# EAGLE design CocoMEMJr_v1.00 (EAGLE 7.7.0)

## Sheet 1 of 4: CPU
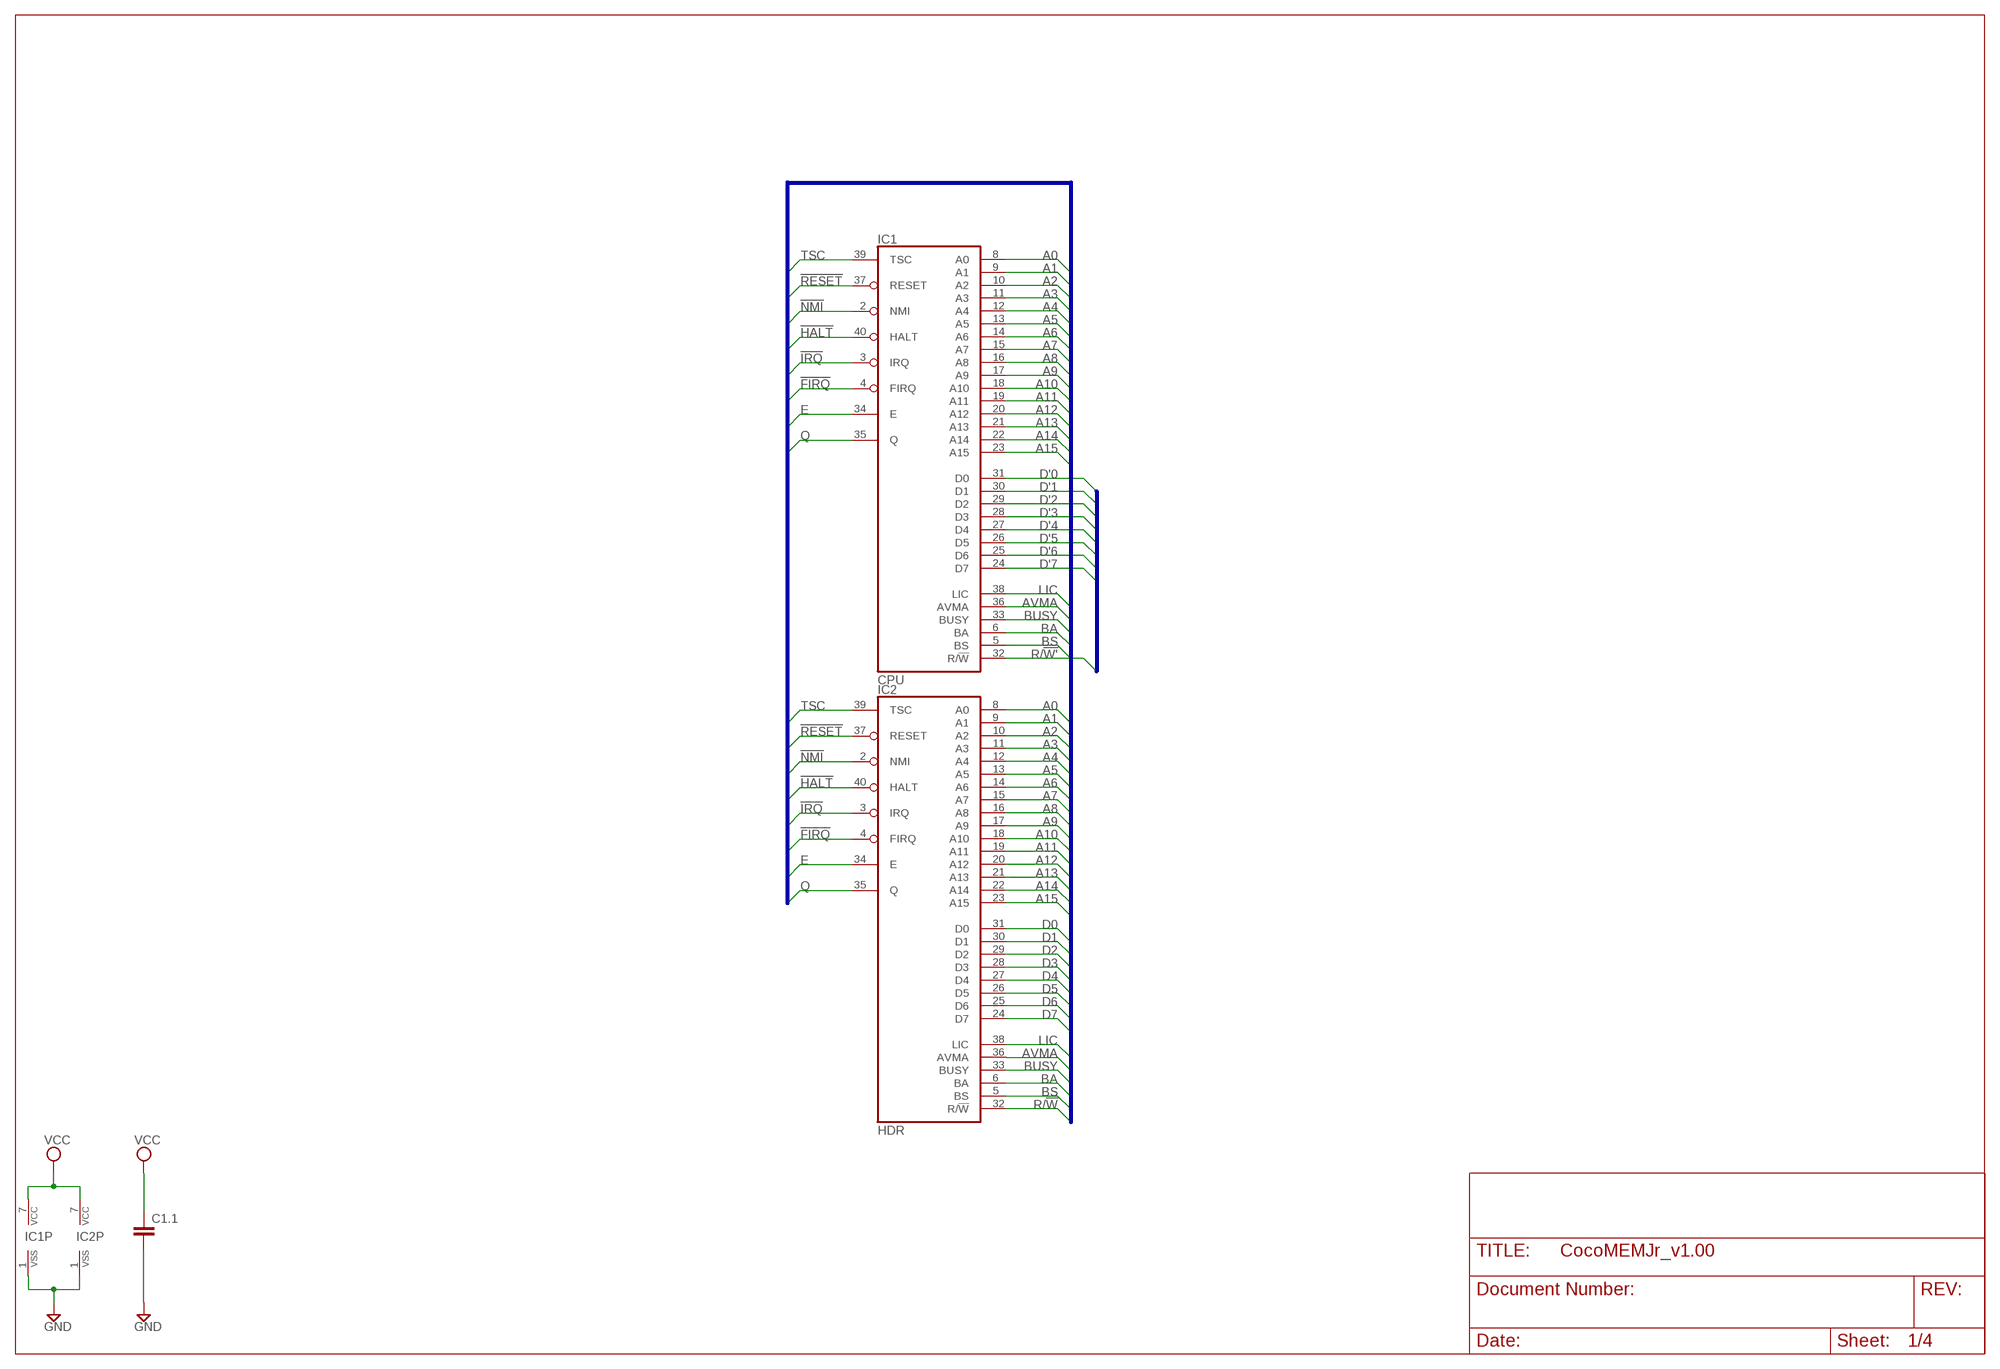
[diagram p0: schematic, sheet 1]

### Parts
C1.1  C-EUC0402  [C0402]
IC1  CPU  MC6809ER  [DIL40-ROUNDPAD]
IC2  HDR  MC6809ER  [DIL40-ROUNDPAD]

### Nets
!FIRQ: IC1.4(FIRQ) IC2.4(FIRQ)
!HALT: IC1.40(HALT) IC2.40(HALT)
!IRQ: IC1.3(IRQ) IC2.3(IRQ)
!NMI: IC1.2(NMI) IC2.2(NMI)
!RESET: IC1.37(RESET) IC2.37(RESET) ; also sheet 2
A0: IC1.8(A0) IC2.8(A0) ; also sheet 2,3
A1: IC1.9(A1) IC2.9(A1) ; also sheet 2,3
A2: IC1.10(A2) IC2.10(A2) ; also sheet 2,3
A3: IC1.11(A3) IC2.11(A3) ; also sheet 2,3
A4: IC1.12(A4) IC2.12(A4) ; also sheet 2,3
A5: IC1.13(A5) IC2.13(A5) ; also sheet 2,3
A6: IC1.14(A6) IC2.14(A6) ; also sheet 2,3
A7: IC1.15(A7) IC2.15(A7) ; also sheet 2,3
A8: IC1.16(A8) IC2.16(A8) ; also sheet 2,3
A9: IC1.17(A9) IC2.17(A9) ; also sheet 2,3
A10: IC1.18(A10) IC2.18(A10) ; also sheet 2,3
A11: IC1.19(A11) IC2.19(A11) ; also sheet 2,3
A12: IC1.20(A12) IC2.20(A12) ; also sheet 2,3
A13: IC1.21(A13) IC2.21(A13) ; also sheet 2
A14: IC1.22(A14) IC2.22(A14) ; also sheet 2
A15: IC1.23(A15) IC2.23(A15) ; also sheet 2
AVMA: IC1.36(AVMA) IC2.36(AVMA)
BA: IC1.6(BA) IC2.6(BA)
BS: IC1.5(BS) IC2.5(BS)
BUSY: IC1.33(BUSY) IC2.33(BUSY)
D0: IC2.31(D0) ; also sheet 2
D1: IC2.30(D1) ; also sheet 2
D2: IC2.29(D2) ; also sheet 2
D3: IC2.28(D3) ; also sheet 2
D4: IC2.27(D4) ; also sheet 2
D5: IC2.26(D5) ; also sheet 2
D6: IC2.25(D6) ; also sheet 2
D7: IC2.24(D7) ; also sheet 2
D'0: IC1.31(D0) ; also sheet 2
D'1: IC1.30(D1) ; also sheet 2
D'2: IC1.29(D2) ; also sheet 2
D'3: IC1.28(D3) ; also sheet 2
D'4: IC1.27(D4) ; also sheet 2
D'5: IC1.26(D5) ; also sheet 2
D'6: IC1.25(D6) ; also sheet 2
D'7: IC1.24(D7) ; also sheet 2
E: IC1.34(E) IC2.34(E) ; also sheet 2
GND: C1.1.2 IC1.1(VSS) IC2.1(VSS) ; also sheet 2,3,4
LIC: IC1.38(LIC) IC2.38(LIC)
Q: IC1.35(Q) IC2.35(Q) ; also sheet 2
R/!W: IC2.32(R/!W) ; also sheet 2
R/!W': IC1.32(R/!W) ; also sheet 2
TSC: IC1.39(TSC) IC2.39(TSC)
VCC: C1.1.1 IC1.7(VCC) IC2.7(VCC) ; also sheet 3,4

### Buses
TSC,LIC,!RESET,!NMI,!HALT,!IRQ,!FIRQ,AVMA,BUSY,A[0..15],D[0..7],E,Q,BA,BS,R/!W
R/!W',D'[0..7]

## Sheet 2 of 4: LOGIC
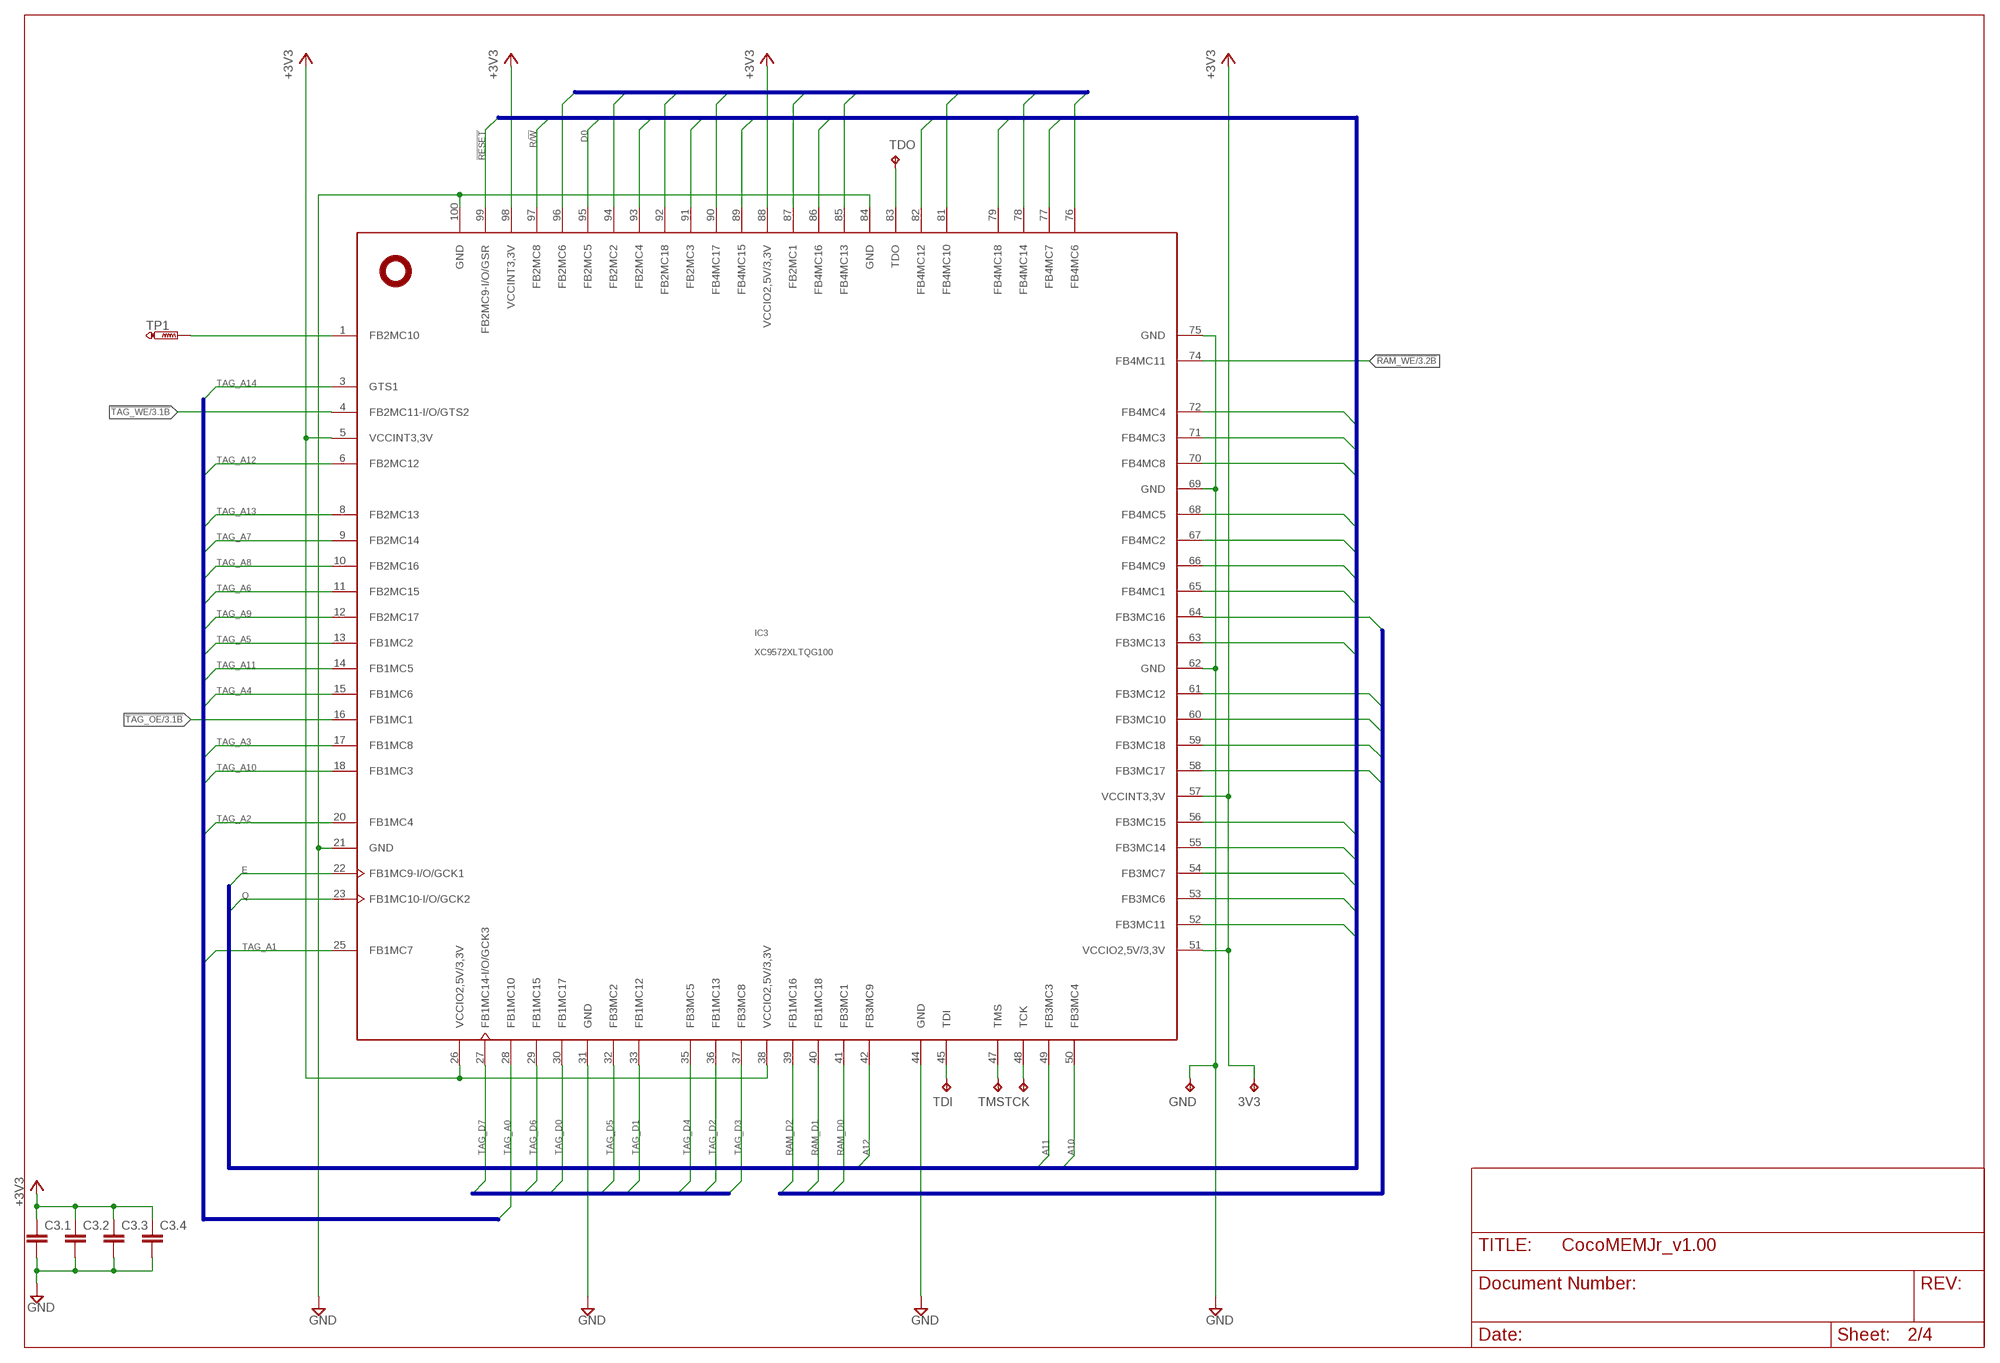
[diagram p1: schematic, sheet 2]

### Parts
3V3  TPTP08R  [TP08R]
C3.1  C-EUC0402  [C0402]
C3.2  C-EUC0402  [C0402]
C3.3  C-EUC0402  [C0402]
C3.4  C-EUC0402  [C0402]
GND  TPTP08R  [TP08R]
IC3  XC9572XLTQG100  [TQFP100]
TCK  TPTP08R  [TP08R]
TDI  TPTP08R  [TP08R]
TDO  TPTP08R  [TP08R]
TMS  TPTP08R  [TP08R]
TP1  PTR1B2,54  [B2,54]

### Nets
!RAM_WE: IC3.74(FB4MC11) ; also sheet 3
!RESET: IC3.99(FB2MC9-I/O/GSR) ; also sheet 1
!TAG_OE: IC3.16(FB1MC1) ; also sheet 3
!TAG_WE: IC3.4(FB2MC11-I/O/GTS2) ; also sheet 3
+3V3: 3V3.TP C3.1.1 C3.2.1 C3.3.1 C3.4.1 IC3.5(VCCINT3,3V) IC3.26(VCCIO2,5V/3,3V) IC3.38(VCCIO2,5V/3,3V) IC3.51(VCCIO2,5V/3,3V) IC3.57(VCCINT3,3V) IC3.88(VCCIO2,5V/3,3V) IC3.98(VCCINT3,3V) ; also sheet 4
A0: IC3.72(FB4MC4) ; also sheet 1,3
A1: IC3.71(FB4MC3) ; also sheet 1,3
A2: IC3.70(FB4MC8) ; also sheet 1,3
A3: IC3.68(FB4MC5) ; also sheet 1,3
A4: IC3.52(FB3MC11) ; also sheet 1,3
A5: IC3.67(FB4MC2) ; also sheet 1,3
A6: IC3.53(FB3MC6) ; also sheet 1,3
A7: IC3.54(FB3MC7) ; also sheet 1,3
A8: IC3.55(FB3MC14) ; also sheet 1,3
A9: IC3.56(FB3MC15) ; also sheet 1,3
A10: IC3.50(FB3MC4) ; also sheet 1,3
A11: IC3.49(FB3MC3) ; also sheet 1,3
A12: IC3.42(FB3MC9) ; also sheet 1,3
A13: IC3.63(FB3MC13) ; also sheet 1
A14: IC3.65(FB4MC1) ; also sheet 1
A15: IC3.66(FB4MC9) ; also sheet 1
D0: IC3.95(FB2MC5) ; also sheet 1
D1: IC3.93(FB2MC4) ; also sheet 1
D2: IC3.91(FB2MC3) ; also sheet 1
D3: IC3.89(FB4MC15) ; also sheet 1
D4: IC3.86(FB4MC16) ; also sheet 1
D5: IC3.82(FB4MC12) ; also sheet 1
D6: IC3.79(FB4MC18) ; also sheet 1
D7: IC3.77(FB4MC7) ; also sheet 1
D'0: IC3.94(FB2MC2) ; also sheet 1
D'1: IC3.92(FB2MC18) ; also sheet 1
D'2: IC3.90(FB4MC17) ; also sheet 1
D'3: IC3.87(FB2MC1) ; also sheet 1
D'4: IC3.85(FB4MC13) ; also sheet 1
D'5: IC3.81(FB4MC10) ; also sheet 1
D'6: IC3.78(FB4MC14) ; also sheet 1
D'7: IC3.76(FB4MC6) ; also sheet 1
E: IC3.22(FB1MC9-I/O/GCK1) ; also sheet 1
GND: C3.1.2 C3.2.2 C3.3.2 C3.4.2 GND.TP IC3.21(GND) IC3.31(GND) IC3.44(GND) IC3.62(GND) IC3.69(GND) IC3.75(GND) IC3.84(GND) IC3.100(GND) ; also sheet 1,3,4
N$1: IC3.1(FB2MC10) TP1.TP
N$5: IC3.45(TDI) TDI.TP
N$6: IC3.47(TMS) TMS.TP
N$7: IC3.48(TCK) TCK.TP
N$8: IC3.83(TDO) TDO.TP
Q: IC3.23(FB1MC10-I/O/GCK2) ; also sheet 1
R/!W: IC3.97(FB2MC8) ; also sheet 1
R/!W': IC3.96(FB2MC6) ; also sheet 1
RAM_D0: IC3.41(FB3MC1) ; also sheet 3
RAM_D1: IC3.40(FB1MC18) ; also sheet 3
RAM_D2: IC3.39(FB1MC16) ; also sheet 3
RAM_D3: IC3.58(FB3MC17) ; also sheet 3
RAM_D4: IC3.59(FB3MC18) ; also sheet 3
RAM_D5: IC3.60(FB3MC10) ; also sheet 3
RAM_D6: IC3.61(FB3MC12) ; also sheet 3
RAM_D7: IC3.64(FB3MC16) ; also sheet 3
TAG_A0: IC3.28(FB1MC10) ; also sheet 3
TAG_A1: IC3.25(FB1MC7) ; also sheet 3
TAG_A2: IC3.20(FB1MC4) ; also sheet 3
TAG_A3: IC3.17(FB1MC8) ; also sheet 3
TAG_A4: IC3.15(FB1MC6) ; also sheet 3
TAG_A5: IC3.13(FB1MC2) ; also sheet 3
TAG_A6: IC3.11(FB2MC15) ; also sheet 3
TAG_A7: IC3.9(FB2MC14) ; also sheet 3
TAG_A8: IC3.10(FB2MC16) ; also sheet 3
TAG_A9: IC3.12(FB2MC17) ; also sheet 3
TAG_A10: IC3.18(FB1MC3) ; also sheet 3
TAG_A11: IC3.14(FB1MC5) ; also sheet 3
TAG_A12: IC3.6(FB2MC12) ; also sheet 3
TAG_A13: IC3.8(FB2MC13) ; also sheet 3
TAG_A14: IC3.3(GTS1) ; also sheet 3
TAG_D0: IC3.30(FB1MC17) ; also sheet 3
TAG_D1: IC3.33(FB1MC12) ; also sheet 3
TAG_D2: IC3.36(FB1MC13) ; also sheet 3
TAG_D3: IC3.37(FB3MC8) ; also sheet 3
TAG_D4: IC3.35(FB3MC5) ; also sheet 3
TAG_D5: IC3.32(FB3MC2) ; also sheet 3
TAG_D6: IC3.29(FB1MC15) ; also sheet 3
TAG_D7: IC3.27(FB1MC14-I/O/GCK3) ; also sheet 3

### Buses
TSC,LIC,!RESET,!NMI,!HALT,!IRQ,!FIRQ,AVMA,BUSY,A[0..15],D[0..7],E,Q,BA,BS,R/!W
R/!W',D'[0..7]
RAM_D[0..7]
TAG_D[0..7]
TAG_A[0..14]

## Sheet 3 of 4: MEMORY
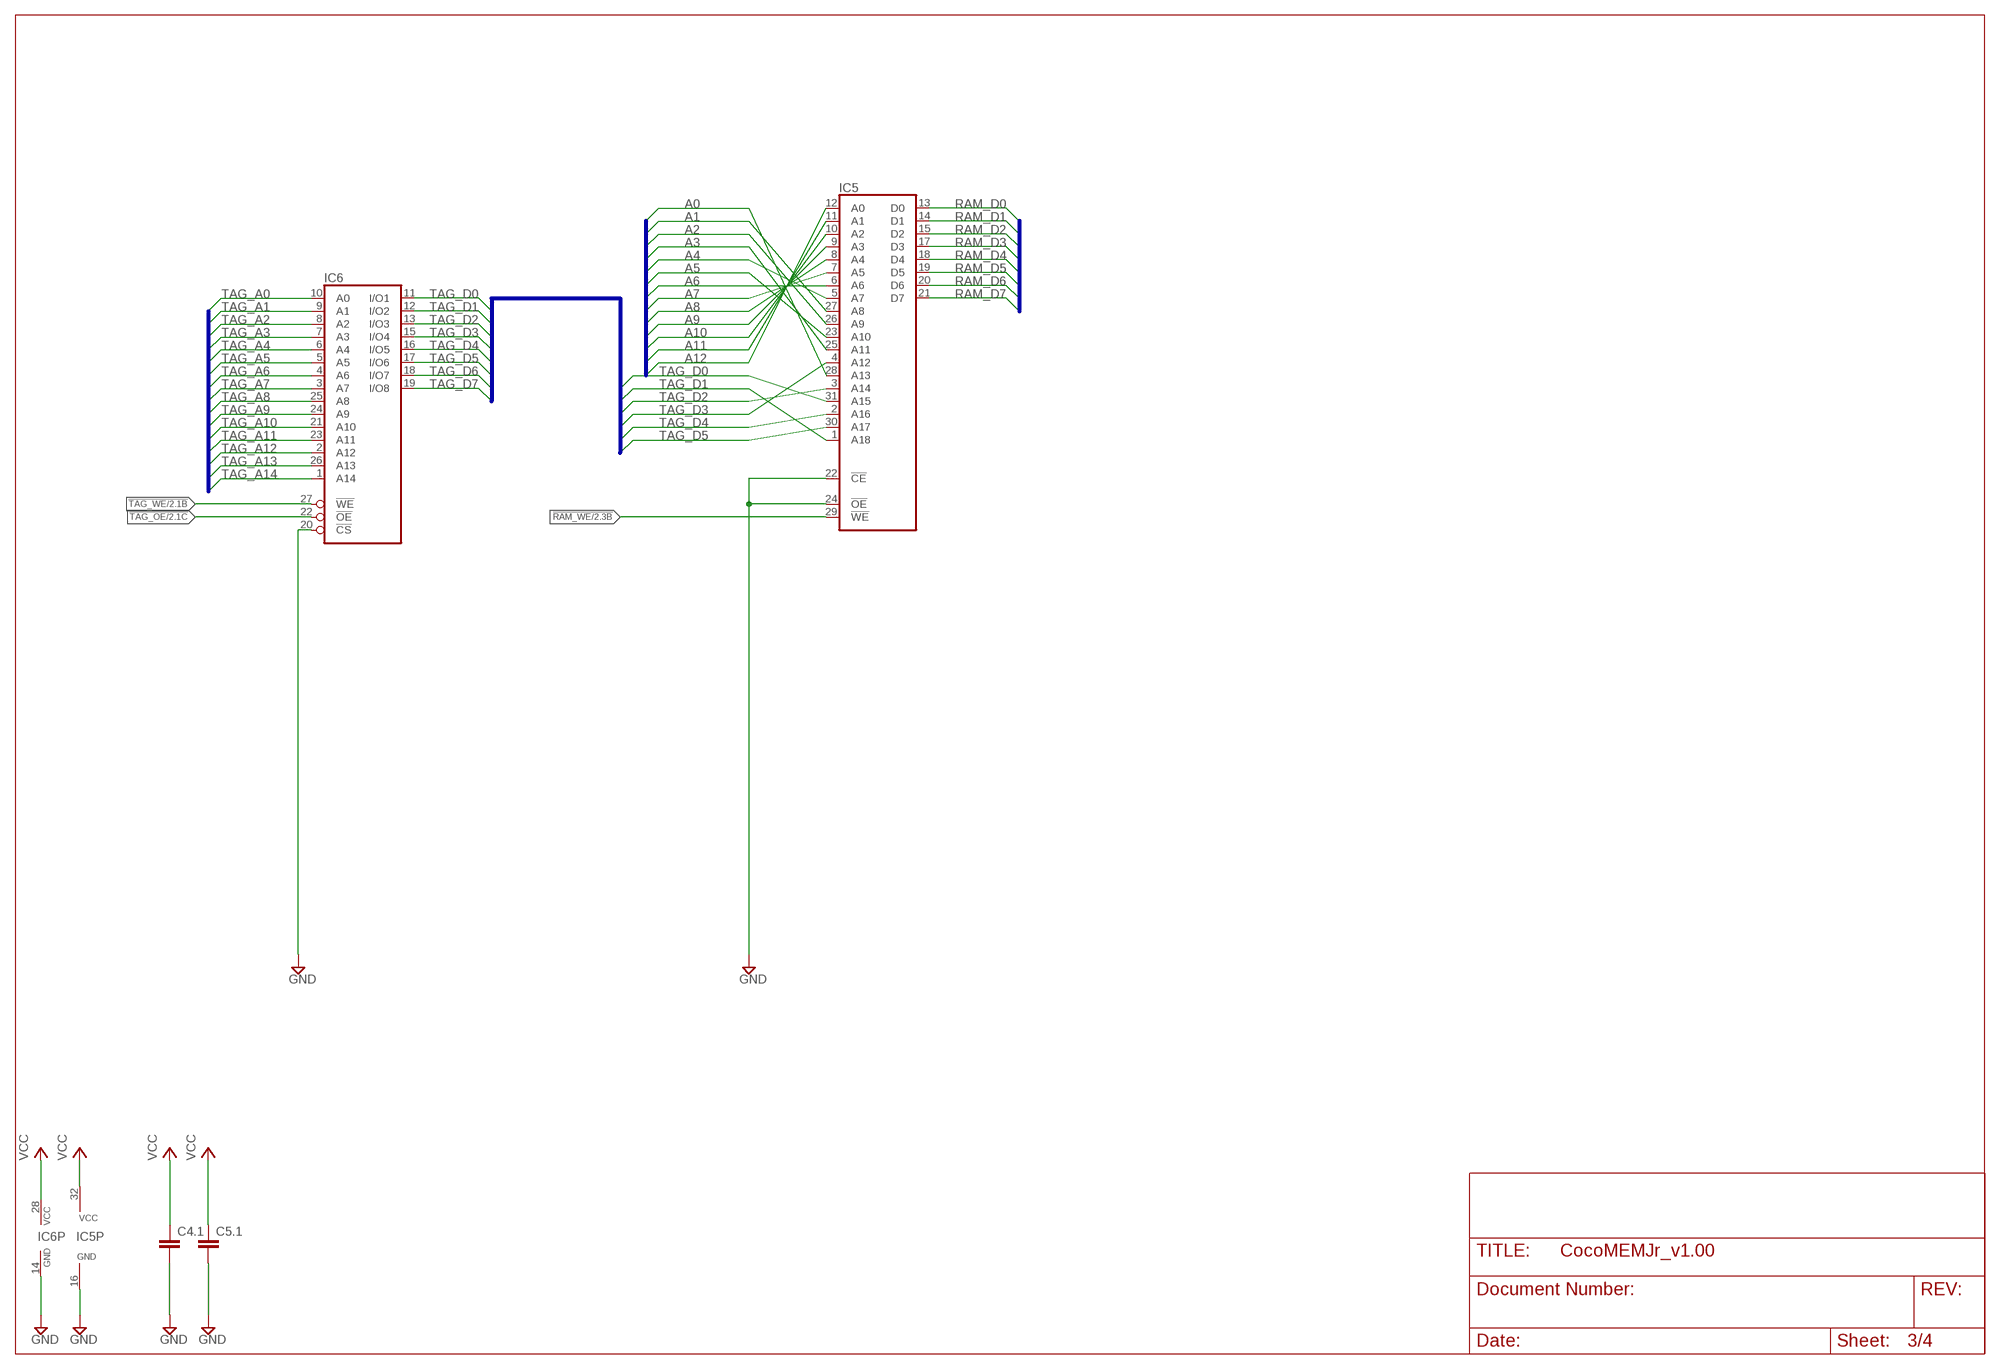
[diagram p2: schematic, sheet 3]

### Parts
C4.1  C-EUC0402  [C0402]
C5.1  C-EUC0402  [C0402]
IC5  AS6C4008PCNR  [DIL32-RP]
IC6  71256SAR  [DIL28-3RP]

### Nets
!RAM_WE: IC5.29(!WE) ; also sheet 2
!TAG_OE: IC6.22(!OE) ; also sheet 2
!TAG_WE: IC6.27(!WE) ; also sheet 2
A0: IC5.28(A13) ; also sheet 1,2
A1: IC5.27(A8) ; also sheet 1,2
A2: IC5.26(A9) ; also sheet 1,2
A3: IC5.25(A11) ; also sheet 1,2
A4: IC5.5(A7) ; also sheet 1,2
A5: IC5.23(A10) ; also sheet 1,2
A6: IC5.6(A6) ; also sheet 1,2
A7: IC5.7(A5) ; also sheet 1,2
A8: IC5.8(A4) ; also sheet 1,2
A9: IC5.9(A3) ; also sheet 1,2
A10: IC5.10(A2) ; also sheet 1,2
A11: IC5.11(A1) ; also sheet 1,2
A12: IC5.12(A0) ; also sheet 1,2
GND: C4.1.2 C5.1.2 IC5.16(GND) IC5.22(!CE) IC5.24(!OE) IC6.14(GND) IC6.20(!CS) ; also sheet 1,2,4
RAM_D0: IC5.13(D0) ; also sheet 2
RAM_D1: IC5.14(D1) ; also sheet 2
RAM_D2: IC5.15(D2) ; also sheet 2
RAM_D3: IC5.17(D3) ; also sheet 2
RAM_D4: IC5.18(D4) ; also sheet 2
RAM_D5: IC5.19(D5) ; also sheet 2
RAM_D6: IC5.20(D6) ; also sheet 2
RAM_D7: IC5.21(D7) ; also sheet 2
TAG_A0: IC6.10(A0) ; also sheet 2
TAG_A1: IC6.9(A1) ; also sheet 2
TAG_A2: IC6.8(A2) ; also sheet 2
TAG_A3: IC6.7(A3) ; also sheet 2
TAG_A4: IC6.6(A4) ; also sheet 2
TAG_A5: IC6.5(A5) ; also sheet 2
TAG_A6: IC6.4(A6) ; also sheet 2
TAG_A7: IC6.3(A7) ; also sheet 2
TAG_A8: IC6.25(A8) ; also sheet 2
TAG_A9: IC6.24(A9) ; also sheet 2
TAG_A10: IC6.21(A10) ; also sheet 2
TAG_A11: IC6.23(A11) ; also sheet 2
TAG_A12: IC6.2(A12) ; also sheet 2
TAG_A13: IC6.26(A13) ; also sheet 2
TAG_A14: IC6.1(A14) ; also sheet 2
TAG_D0: IC5.31(A15) IC6.11(I/O1) ; also sheet 2
TAG_D1: IC5.1(A18) IC6.12(I/O2) ; also sheet 2
TAG_D2: IC5.3(A14) IC6.13(I/O3) ; also sheet 2
TAG_D3: IC5.4(A12) IC6.15(I/O4) ; also sheet 2
TAG_D4: IC5.2(A16) IC6.16(I/O5) ; also sheet 2
TAG_D5: IC5.30(A17) IC6.17(I/O6) ; also sheet 2
TAG_D6: IC6.18(I/O7) ; also sheet 2
TAG_D7: IC6.19(I/O8) ; also sheet 2
VCC: C4.1.1 C5.1.1 IC5.32(VCC) IC6.28(VCC) ; also sheet 1,4

### Buses
RAM_D[0..7]
TSC,LIC,!RESET,!NMI,!HALT,!IRQ,!FIRQ,AVMA,BUSY,A[0..15],D[0..7],E,Q,BA,BS,R/!W
TAG_D[0..7]
TAG_A[0..14]

## Sheet 4 of 4: POWER
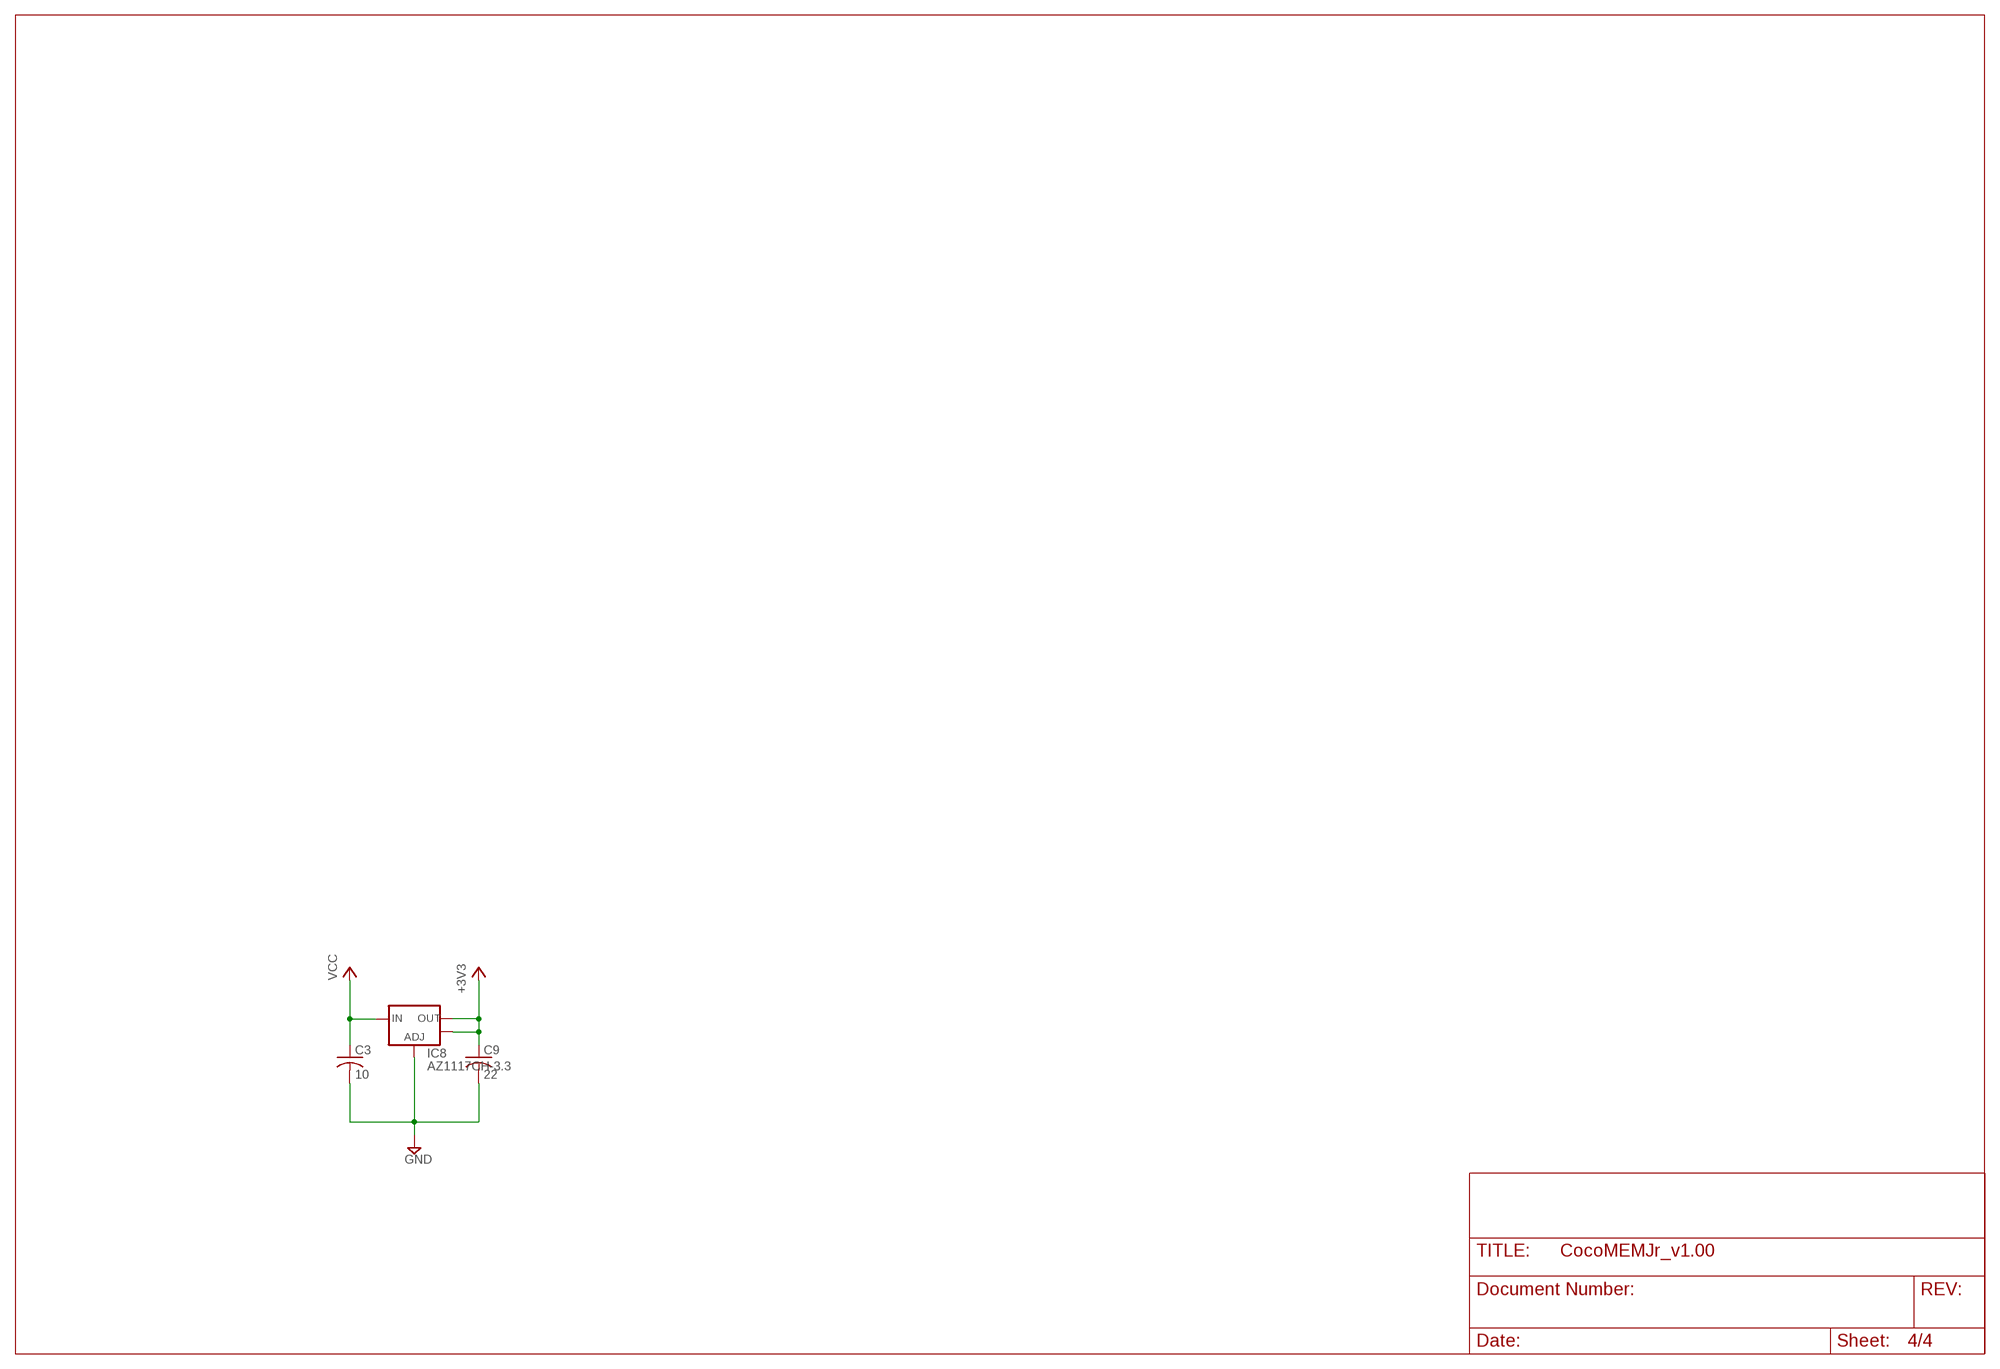
[diagram p3: schematic, sheet 4]

### Parts
C3  10  C-USC0805  [C0805]
C9  22  C-USC0805  [C0805]
IC8  AZ1117CH-3.3  V_REG_LM1117SOT223  [SOT223]

### Nets
+3V3: C9.1 IC8.2(OUT) IC8.4(OUT) ; also sheet 2
GND: C3.2 C9.2 IC8.1(ADJ) ; also sheet 1,2,3
VCC: C3.1 IC8.3(IN) ; also sheet 1,3

## Library data of the parts
3V3 GND TCK TDI TDO TMS = testpad:TP: Test pad
C1.1 C3.1-C3.4 C4.1 C5.1 = rcl:C-EU: CAPACITOR, European symbol
C3 C9 = rcl:C-US: CAPACITOR, American symbol
IC1 IC2 = micro-motorola:MC6809E: MICROCONTROLLER/MEMORY DEVICE
IC3 = xilinx_xc95XXXxl:XC9572XLTQG100
IC5 = memory-alliance:AS6C4008
IC6 = memory-idt-jlb:71256SA: MEMORY
IC8 = SparkFun:V_REG_LM1117: Voltage Regulator LM1117 Standard adjustable voltage regulator but in SMD form. Spark Fun Electronics SKU : COM-00595
TP1 = testpad:PTR1: TEST PIN

## Net classes
1 power: width 0.305 mm, drill 0.305 mm

## Board
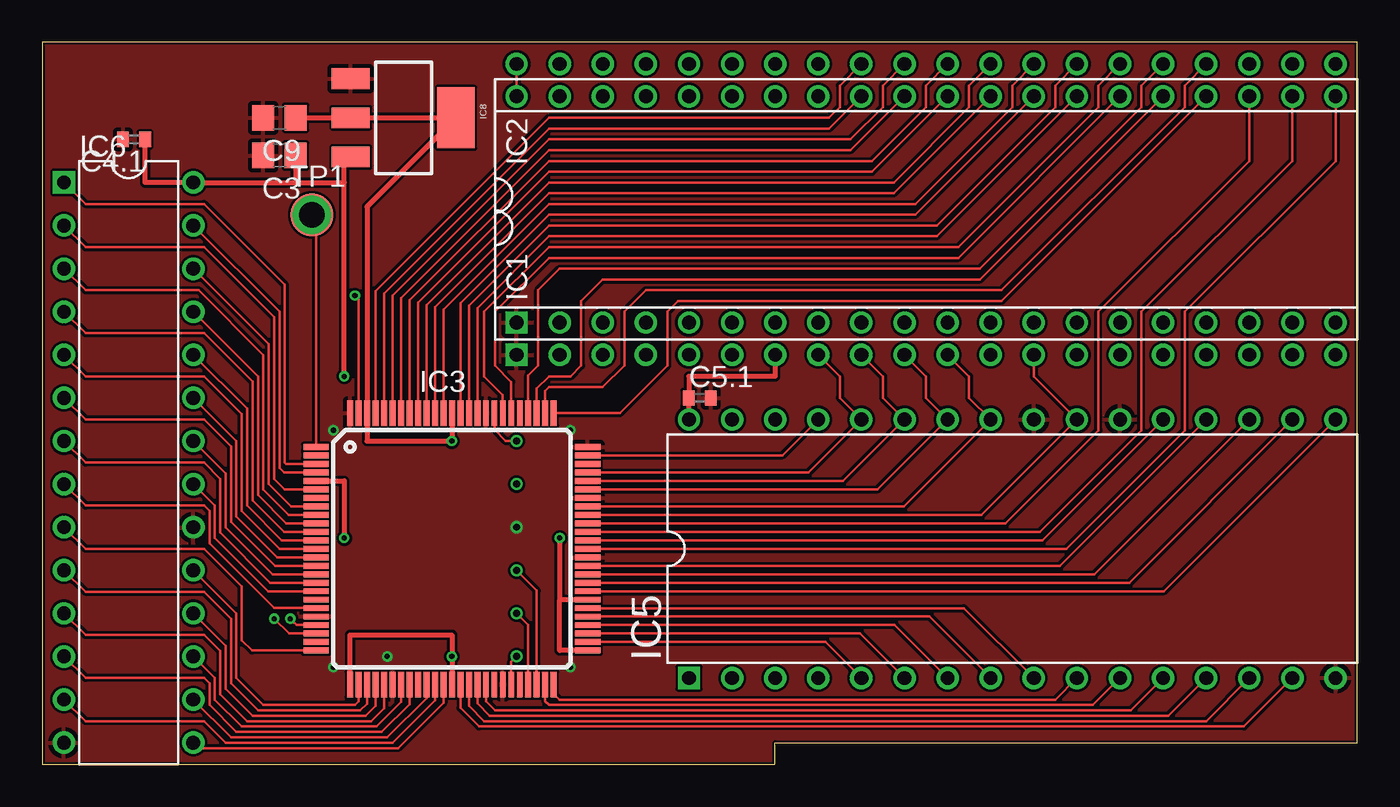
[diagram p4: board, top side]
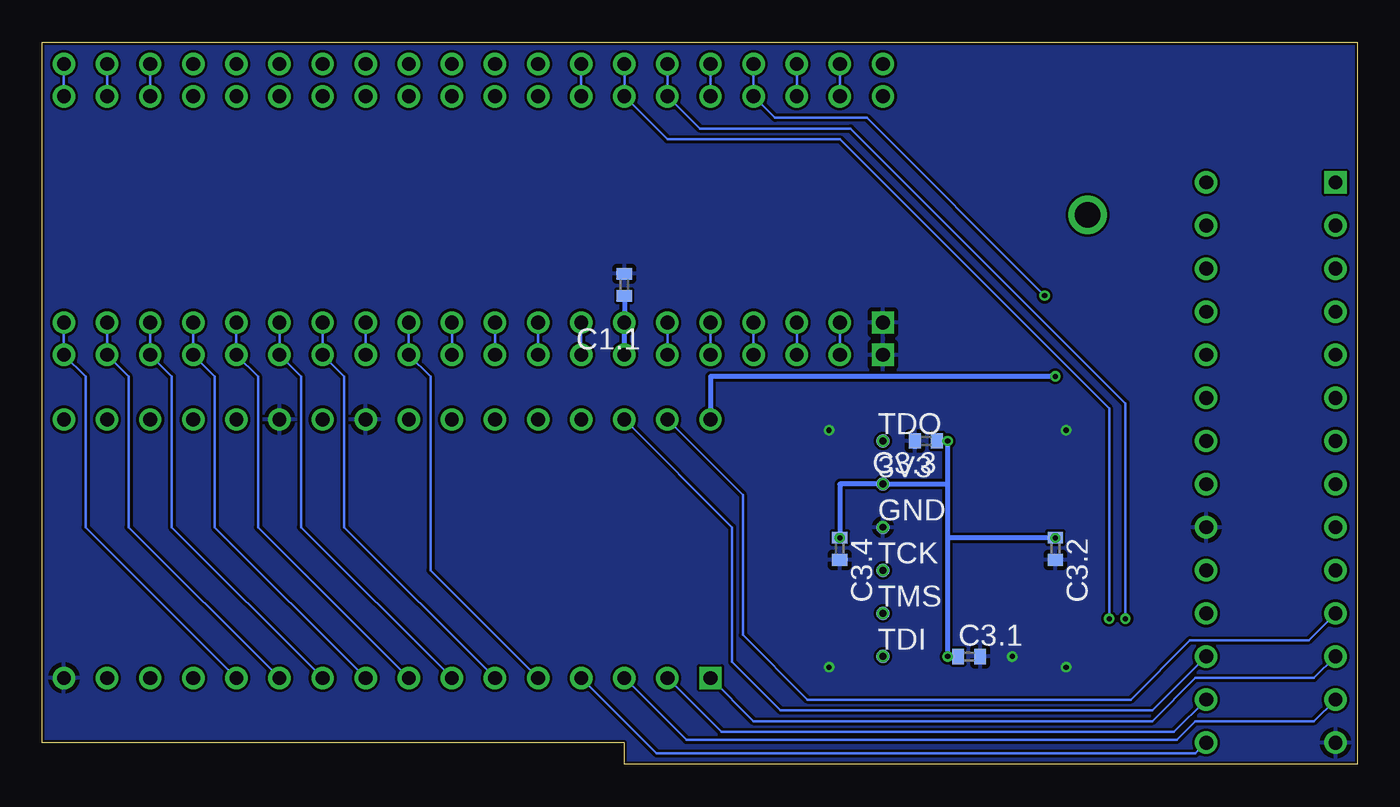
[diagram p5: board, bottom side, seen from below]

Size 77.47 x 42.55 mm. Coordinates in mm from the lower left corner, seen from the top.
Outline: 0,0 43.18,0 43.18,1.27 77.47,1.27 77.47,42.55 0,42.55 0,0
Copper layers (1*16): Top 0.035mm / dielectric 1.5mm / Bottom 0.035mm
Design rules "hackvana *": minimum track width 6mil, minimum drill 0.3mm, track to track 6mil, track to pad 6mil, pad to pad 6mil, via to via 6mil, smd to smd 0mil, copper to edge 6mil, drill to drill 6mil, minimum pad ring 10mil, minimum via ring 6mil, stop-mask expansion 2mil, vias tented up to drill 100mil, thermal gap 10mil

### Footprints (pad centres in the part's own frame; a part is rotated, then mirrored left to right if it is on the bottom)
TP08R = smd 0.8 x 0.8: TP 0,0
C0402 = smd 0.7 x 0.9: 1 -0.65,0; 2 0.65,0
C0805 = smd 1.3 x 1.5: 1 -0.95,0; 2 0.95,0
DIL40-ROUNDPAD = drill 0.813 square: 1 -24.13,-7.62 | drill 0.813: 2 -21.59,-7.62; 3 -19.05,-7.62; 4 -16.51,-7.62; 5 -13.97,-7.62; 6 -11.43,-7.62; 7 -8.89,-7.62; 8 -6.35,-7.62; 9 -3.81,-7.62; 10 -1.27,-7.62; 11 1.27,-7.62; 12 3.81,-7.62; 13 6.35,-7.62; 14 8.89,-7.62; 15 11.43,-7.62; 16 13.97,-7.62; 17 16.51,-7.62; 18 19.05,-7.62; 19 21.59,-7.62; 20 24.13,-7.62; 21 24.13,7.62; 22 21.59,7.62; 23 19.05,7.62; 24 16.51,7.62; 25 13.97,7.62; 26 11.43,7.62; 27 8.89,7.62; 28 6.35,7.62; 29 3.81,7.62; 30 1.27,7.62; 31 -1.27,7.62; 32 -3.81,7.62; 33 -6.35,7.62; 34 -8.89,7.62; 35 -11.43,7.62; 36 -13.97,7.62; 37 -16.51,7.62; 38 -19.05,7.62; 39 -21.59,7.62; 40 -24.13,7.62
TQFP100 = smd 1.5 x 0.35: 1 -8,6; 2 -8,5.5; 3 -8,5; 4 -8,4.5; 5 -8,4; 6 -8,3.5; 7 -8,3; 8 -8,2.5; 9 -8,2; 10 -8,1.5; 11 -8,1; 12 -8,0.5; 13 -8,0; 14 -8,-0.5; 15 -8,-1; 16 -8,-1.5; 17 -8,-2; 18 -8,-2.5; 19 -8,-3; 20 -8,-3.5; 21 -8,-4; 22 -8,-4.5; 23 -8,-5; 24 -8,-5.5; 25 -8,-6; 51 8,-6; 52 8,-5.5; 53 8,-5; 54 8,-4.5; 55 8,-4; 56 8,-3.5; 57 8,-3; 58 8,-2.5; 59 8,-2; 60 8,-1.5; 61 8,-1; 62 8,-0.5; 63 8,0; 64 8,0.5; 65 8,1; 66 8,1.5; 67 8,2; 68 8,2.5; 69 8,3; 70 8,3.5; 71 8,4; 72 8,4.5; 73 8,5; 74 8,5.5; 75 8,6 | smd 0.35 x 1.5: 26 -6,-8; 27 -5.5,-8; 28 -5,-8; 29 -4.5,-8; 30 -4,-8; 31 -3.5,-8; 32 -3,-8; 33 -2.5,-8; 34 -2,-8; 35 -1.5,-8; 36 -1,-8; 37 -0.5,-8; 38 0,-8; 39 0.5,-8; 40 1,-8; 41 1.5,-8; 42 2,-8; 43 2.5,-8; 44 3,-8; 45 3.5,-8; 46 4,-8; 47 4.5,-8; 48 5,-8; 49 5.5,-8; 50 6,-8; 76 6,8; 77 5.5,8; 78 5,8; 79 4.5,8; 80 4,8; 81 3.5,8; 82 3,8; 83 2.5,8; 84 2,8; 85 1.5,8; 86 1,8; 87 0.5,8; 88 0,8; 89 -0.5,8; 90 -1,8; 91 -1.5,8; 92 -2,8; 93 -2.5,8; 94 -3,8; 95 -3.5,8; 96 -4,8; 97 -4.5,8; 98 -5,8; 99 -5.5,8; 100 -6,8
DIL32-RP = drill 0.813 square: 1 -19.05,-7.62 | drill 0.813: 2 -16.51,-7.62; 3 -13.97,-7.62; 4 -11.43,-7.62; 5 -8.89,-7.62; 6 -6.35,-7.62; 7 -3.81,-7.62; 8 -1.27,-7.62; 9 1.27,-7.62; 10 3.81,-7.62; 11 6.35,-7.62; 12 8.89,-7.62; 13 11.43,-7.62; 14 13.97,-7.62; 15 16.51,-7.62; 16 19.05,-7.62; 17 19.05,7.62; 18 16.51,7.62; 19 13.97,7.62; 20 11.43,7.62; 21 8.89,7.62; 22 6.35,7.62; 23 3.81,7.62; 24 1.27,7.62; 25 -1.27,7.62; 26 -3.81,7.62; 27 -6.35,7.62; 28 -8.89,7.62; 29 -11.43,7.62; 30 -13.97,7.62; 31 -16.51,7.62; 32 -19.05,7.62
DIL28-3RP = drill 0.813 square: 1 -16.51,-3.81 | drill 0.813: 2 -13.97,-3.81; 3 -11.43,-3.81; 4 -8.89,-3.81; 5 -6.35,-3.81; 6 -3.81,-3.81; 7 -1.27,-3.81; 8 1.27,-3.81; 9 3.81,-3.81; 10 6.35,-3.81; 11 8.89,-3.81; 12 11.43,-3.81; 13 13.97,-3.81; 14 16.51,-3.81; 15 16.51,3.81; 16 13.97,3.81; 17 11.43,3.81; 18 8.89,3.81; 19 6.35,3.81; 20 3.81,3.81; 21 1.27,3.81; 22 -1.27,3.81; 23 -3.81,3.81; 24 -6.35,3.81; 25 -8.89,3.81; 26 -11.43,3.81; 27 -13.97,3.81; 28 -16.51,3.81
SOT223 = smd 1.219 x 2.235: 1 -2.311,-3.099; 2 0,-3.099; 3 2.311,-3.099 | smd 3.6 x 2.2: 4 0,3.099
B2,54 = smd 2.54 x 2.54: TP 0,0

### Placement (x,y rotation side)
3V3  27.94,16.51 0 bottom
C1.1  43.18,28.26 90 bottom
C3  13.97,35.88 180 top
C3.1  22.86,6.35 0 bottom
C3.2  17.78,12.7 270 bottom
C3.3  25.4,19.05 180 bottom
C3.4  30.48,12.7 270 bottom
C4.1  5.4,36.83 180 top
C5.1  38.73,21.59 0 top
C9  13.97,38.1 180 top
GND  27.94,13.97 0 bottom
IC1  52.07,31.75 0 top
IC2  52.07,33.66 0 top
IC3  24.13,12.7 0 top
IC5  57.15,12.7 0 top
IC6  5.08,17.78 270 top
IC8  21.27,38.1 270 top
TCK  27.94,11.43 0 bottom
TDI  27.94,6.35 0 bottom
TDO  27.94,19.05 0 bottom
TMS  27.94,8.89 0 bottom
TP1  15.88,32.38 0 top

### Tracks (layer width: path | path; a pad name or v marks a point on that pad's centre or on a via)
!FIRQ
  Bottom 0.152: IC2.4 IC1.4
!HALT
  Top 0.152: IC2.40 IC1.40
!IRQ
  Bottom 0.152: IC2.3 IC1.3
!NMI
  Bottom 0.152: IC2.2 IC1.2
!RAM_WE
  Top 0.152: IC5.29 43.6,18.2 IC3.74
!RESET  (via drill 0.3)
  Top 0.152: IC3.99 18.63,27.41 v18.41,27.62
  Bottom 0.152: v18.41,27.62 28.89,38.1 34.29,38.1 IC1.37 IC2.37
!TAG_OE
  Top 0.152: IC3.16 13.57,11.2 10.8,13.97 10.8,17.14 IC6.22
!TAG_WE
  Top 0.152: IC6.27 13.97,26.67 13.97,17.46 14.23,17.2 IC3.4
+3V3  (via drill 0.3, 0.41)
  Top 0.305: IC3.88 v24.13,19.05 19.13,19.05 IC3.98 19.13,32.86 IC8.4 IC8.2 C9.1 | IC3.51 30.48,6.7 30.48,9.7 | IC3.57 30.48,9.7 | IC3.5 17.78,16.7 v17.78,13.33 | IC3.38 v24.13,6.35 24.13,7.62 18.13,7.62 IC3.26 | v30.48,13.33 30.48,9.7
  Bottom 0.305: 24.13,13.33 v17.78,13.33 C3.2.1 | 24.13,13.33 v24.13,6.35 C3.1.1 | 24.13,16.51 v24.13,19.05 C3.3.1 | 24.13,16.51 24.13,13.33 | 24.13,16.51 3V3.TP 30.48,16.51 C3.4.1 v30.48,13.33
  other vias: 27.94,16.51
A0
  Top 0.152: IC1.8 46.99,22.86 46.99,21.59 IC5.28 45.14,17.2 IC3.72
  Bottom 0.152: IC2.8 IC1.8
A1
  Top 0.152: IC1.9 49.53,22.86 49.53,21.59 IC5.27 47.18,16.7 IC3.71
  Bottom 0.152: IC2.9 IC1.9
A2
  Top 0.152: IC1.10 52.07,22.86 52.07,21.59 IC5.26 49.22,16.2 IC3.70
  Bottom 0.152: IC2.10 IC1.10
A3
  Top 0.152: IC1.11 54.61,22.86 54.61,21.59 IC5.25 50.76,15.2 IC3.68
  Bottom 0.152: IC2.11 IC1.11
A4
  Top 0.152: IC3.52 46.14,7.2 IC5.5
  Bottom 0.152: IC5.5 54.61,11.43 54.61,22.86 IC1.12 IC2.12
A5
  Top 0.152: IC1.13 58.42,22.86 IC5.23 55.34,14.7 IC3.67
  Bottom 0.152: IC2.13 IC1.13
A6
  Top 0.152: IC3.53 48.18,7.7 IC5.6
  Bottom 0.152: IC5.6 59.69,13.97 59.69,22.86 IC1.14 IC2.14
A7
  Top 0.152: IC3.54 50.22,8.2 IC5.7
  Bottom 0.152: IC5.7 62.23,13.97 62.23,22.86 IC1.15 IC2.15
A8
  Top 0.152: IC3.55 52.26,8.7 IC5.8
  Bottom 0.152: IC5.8 64.77,13.97 64.77,22.86 IC1.16 IC2.16
A9
  Top 0.152: IC3.56 54.3,9.2 IC5.9
  Bottom 0.152: IC5.9 67.31,13.97 67.31,22.86 IC1.17 IC2.17
A10
  Top 0.152: IC3.50 30.13,4.16 30.48,3.81 59.69,3.81 IC5.10
  Bottom 0.152: IC5.10 69.85,13.97 69.85,22.86 IC1.18 IC2.18
A11
  Top 0.152: IC3.49 29.63,3.71 29.85,3.49 61.91,3.49 IC5.11
  Bottom 0.152: IC5.11 72.39,13.97 72.39,22.86 IC1.19 IC2.19
A12
  Top 0.152: IC5.12 64.14,3.18 26.67,3.18 26.13,3.71 IC3.42
  Bottom 0.152: IC5.12 74.93,13.97 74.93,22.86 IC1.20 IC2.20
A13
  Top 0.152: IC3.63 60.33,12.7 67.31,19.68 67.31,26.67 76.2,35.56 IC1.21
  Bottom 0.152: IC2.21 IC1.21
A14
  Top 0.152: IC3.65 58.79,13.7 64.77,19.68 64.77,26.67 73.66,35.56 IC1.22
  Bottom 0.152: IC2.22 IC1.22
A15
  Top 0.152: IC1.23 71.12,35.56 62.23,26.67 62.23,19.68 56.75,14.2 IC3.66
  Bottom 0.152: IC2.23 IC1.23
AVMA
  Bottom 0.152: IC2.36 IC1.36
BA
  Bottom 0.152: IC2.6 IC1.6
BS
  Bottom 0.152: IC2.5 IC1.5
BUSY
  Bottom 0.152: IC2.33 IC1.33
D0
  Top 0.152: IC3.95 20.63,27.61 29.85,36.83 47.62,36.83 49.53,38.73 49.53,40 IC2.31
D1
  Top 0.152: IC3.93 21.63,27.34 29.85,35.56 48.9,35.56 52.07,38.73 52.07,40 IC2.30
D2
  Top 0.152: IC3.91 22.63,27.07 29.85,34.29 50.17,34.29 54.61,38.73 54.61,40 IC2.29
D3
  Top 0.152: IC3.89 23.63,26.8 29.85,33.02 51.44,33.02 57.15,38.73 57.15,40 IC2.28
D4
  Top 0.152: IC3.86 25.13,27.04 29.85,31.75 52.7,31.75 59.69,38.73 59.69,40 IC2.27
D5
  Top 0.152: IC3.82 27.13,21.77 26.04,22.86 26.04,26.67 29.85,30.48 53.98,30.48 62.23,38.73 62.23,40 IC2.26
D6
  Top 0.152: IC3.79 28.63,22.91 29.21,23.5 29.21,27.94 30.48,29.21 55.25,29.21 64.77,38.73 64.77,40 IC2.25
D7
  Top 0.152: IC3.77 29.63,22.01 29.85,22.22 33.02,22.22 34.29,23.5 34.29,26.67 35.56,27.94 56.52,27.94 67.31,38.73 67.31,40 IC2.24
D'0
  Top 0.152: IC3.94 21.13,27.48 29.85,36.2 47.62,36.2 IC1.31
D'1
  Top 0.152: IC3.92 22.13,27.21 29.85,34.92 48.9,34.92 IC1.30
D'2
  Top 0.152: IC3.90 23.13,26.94 29.85,33.66 50.17,33.66 IC1.29
D'3
  Top 0.152: IC3.87 24.63,27.17 29.85,32.38 51.44,32.38 IC1.28
D'4
  Top 0.152: IC3.85 25.63,26.9 29.85,31.12 52.7,31.12 IC1.27
D'5
  Top 0.152: IC3.81 27.63,22.54 26.67,23.5 26.67,26.67 29.85,29.84 53.98,29.84 IC1.26
D'6
  Top 0.152: IC3.78 29.13,22.14 29.85,22.86 31.12,22.86 31.75,23.5 31.75,27.3 33.02,28.57 55.25,28.57 IC1.25
D'7
  Top 0.152: IC3.76 34.04,20.7 36.83,23.5 36.83,26.67 37.47,27.3 56.52,27.3 IC1.24
E  (via drill 0.3)
  Top 0.152: 14.84,8.33 v14.61,8.57 14.98,8.2 IC3.22
  Bottom 0.152: IC2.34 IC1.34 40.64,36.83 30.48,36.83 14.61,20.95 v14.61,8.57
GND  (via drill 0.3, 0.41)
  other vias: 27.94,13.97 17.15,19.68 31.12,19.68 31.12,5.71 17.15,5.71 20.32,6.35
  pour Bottom: 0,42.55 77.47,42.55 77.47,1.27 43.18,1.27 43.18,0 0,0
  pour Top: 0,42.55 77.47,42.55 77.47,1.27 43.18,1.27 43.18,0 0,0
LIC
  Bottom 0.152: IC2.38 IC1.38
N$1  (via drill 1.5)
  Top 0.152: IC3.1 16.13,32.13 TP1.TP
  other vias: 15.88,32.38
N$5  (via drill 0.41)
  Top 0.152: IC3.45 27.63,6.04 TDI.TP
  other vias: 27.94,6.35
N$6  (via drill 0.41)
  Top 0.152: IC3.47 28.63,8.2 TMS.TP
  other vias: 27.94,8.89
N$7  (via drill 0.41)
  Top 0.152: IC3.48 29.13,10.24 TCK.TP
  other vias: 27.94,11.43
N$8  (via drill 0.41)
  Top 0.152: IC3.83 26.63,19.73 27.31,19.05 TDO.TP
  other vias: 27.94,19.05
Q  (via drill 0.3)
  Top 0.152: v13.65,8.57 14.53,7.7 IC3.23
  Bottom 0.152: IC2.35 IC1.35 38.73,37.47 29.85,37.47 13.65,21.27 v13.65,8.57
R/!W
  Top 0.152: IC2.32 46.99,40 46.99,38.73 46.36,38.1 29.85,38.1 19.63,27.88 IC3.97
R/!W'
  Top 0.152: IC1.32 46.36,37.47 29.85,37.47 20.13,27.75 IC3.96
RAM_D0
  Top 0.152: IC5.13 66.36,2.86 26.35,2.86 25.63,3.58 IC3.41
RAM_D1
  Top 0.152: IC5.14 68.58,2.54 26.04,2.54 25.13,3.45 IC3.40
RAM_D2
  Top 0.152: IC5.15 70.8,2.22 25.72,2.22 24.63,3.31 IC3.39
RAM_D3
  Top 0.152: IC3.58 66.08,10.2 IC5.17
RAM_D4
  Top 0.152: IC3.59 64.04,10.7 IC5.18
RAM_D5
  Top 0.152: IC3.60 62,11.2 IC5.19
RAM_D6
  Top 0.152: IC3.61 59.96,11.7 IC5.20
RAM_D7
  Top 0.152: IC5.21 58.92,13.2 IC3.64
TAG_A0
  Top 0.152: IC6.10 2.54,10.16 9.53,10.16 11.11,8.57 11.11,4.76 12.7,3.18 18.73,3.18 19.13,3.57 IC3.28
TAG_A1
  Top 0.152: IC3.25 12.35,6.7 11.75,7.3 11.75,10.48 9.53,12.7 2.54,12.7 IC6.9
TAG_A2
  Top 0.152: IC3.20 15.57,9.2 15.56,9.21 13.65,9.21 9.84,13.02 9.84,14.92 9.53,15.24 2.54,15.24 IC6.8
TAG_A3
  Top 0.152: IC3.17 13.43,10.7 10.48,13.65 10.48,16.83 9.53,17.78 2.54,17.78 IC6.7
TAG_A4
  Top 0.152: IC6.6 2.54,20.32 9.53,20.32 11.11,18.73 11.11,14.29 13.7,11.7 IC3.15
TAG_A5
  Top 0.152: IC6.5 2.54,22.86 9.53,22.86 11.75,20.64 11.75,14.92 13.97,12.7 IC3.13
TAG_A6
  Top 0.152: IC6.4 2.54,25.4 9.53,25.4 12.38,22.54 12.38,15.56 14.24,13.7 IC3.11
TAG_A7
  Top 0.152: IC6.3 2.54,27.94 9.21,27.94 13.02,24.13 13.02,16.19 14.51,14.7 IC3.9
TAG_A8
  Top 0.152: IC6.25 12.7,22.86 12.7,15.88 14.38,14.2 IC3.10
TAG_A9
  Top 0.152: IC6.24 12.07,20.95 12.07,15.24 14.11,13.2 IC3.12
TAG_A10
  Top 0.152: IC3.18 13.3,10.2 10.16,13.33 10.16,15.24 IC6.21
TAG_A11
  Top 0.152: IC6.23 11.43,19.05 11.43,14.6 13.84,12.2 IC3.14
TAG_A12
  Top 0.152: IC6.2 2.54,30.48 9.53,30.48 13.65,26.35 13.65,16.83 14.28,16.2 IC3.6
TAG_A13
  Top 0.152: IC6.26 13.34,24.77 13.34,16.51 14.65,15.2 IC3.8
TAG_A14
  Top 0.152: IC6.1 2.54,33.02 9.53,33.02 14.29,28.26 14.29,17.78 14.37,17.7 IC3.3
TAG_D0
  Top 0.152: IC6.11 2.54,7.62 9.53,7.62 10.48,6.67 10.48,4.13 12.07,2.54 19.37,2.54 20.13,3.3 IC3.30
  Bottom 0.152: IC5.31 36.2,15.88 36.2,7.62 32.39,3.81 13.34,3.81 9.84,7.3 2.86,7.3 IC6.11
TAG_D1
  Top 0.152: IC6.12 2.54,5.08 9.53,5.08 9.84,4.76 9.84,3.49 11.43,1.91 20,1.91 21.63,3.53 IC3.33
  Bottom 0.152: IC5.1 35.56,2.54 12.07,2.54 9.53,5.08 2.54,5.08 IC6.12
TAG_D2
  Top 0.152: IC6.13 2.54,2.54 9.53,2.54 10.8,1.27 20.64,1.27 23.13,3.76 IC3.36
  Bottom 0.152: IC5.3 39.53,1.43 10.64,1.43 9.53,2.54 2.54,2.54 IC6.13
TAG_D3
  Top 0.152: IC6.15 9.21,0.95 20.96,0.95 23.63,3.63 IC3.37
  Bottom 0.152: IC5.4 41.28,0.63 9.53,0.63 IC6.15
TAG_D4
  Top 0.152: IC6.16 11.11,1.59 20.32,1.59 22.63,3.9 IC3.35
  Bottom 0.152: IC5.2 37.47,1.91 10.8,1.91 IC6.16
TAG_D5
  Top 0.152: IC6.17 10.16,5.08 10.16,3.81 11.75,2.22 19.69,2.22 21.13,3.67 IC3.32
  Bottom 0.152: IC6.17 12.07,3.18 33.97,3.18 36.83,6.03 36.83,12.7 36.83,13.65 36.83,13.97 IC5.30
TAG_D6
  Top 0.152: IC6.18 10.8,6.98 10.8,4.45 12.38,2.86 19.05,2.86 19.63,3.44 IC3.29
TAG_D7
  Top 0.152: IC3.27 18.63,3.71 18.41,3.49 13.02,3.49 11.43,5.08 11.43,8.89 IC6.19
TSC
  Bottom 0.152: IC2.39 IC1.39
VCC  (via drill 0.3)
  Top 0.305: IC5.32 38.09,20.34 C5.1.1 38.1,21.59 38.1,22.86 43.18,22.86 IC1.7 | C4.1.1 6.05,34.29 IC6.28 14.92,34.29 | v17.78,22.86 17.78,34.29 | 17.78,34.29 17.78,35.79 IC8.3 | 14.92,34.29 17.78,34.29 | C3.1 14.92,34.29
  Bottom 0.305: IC1.7 IC2.7 C1.1.1 | v17.78,22.86 38.1,22.86 IC5.32